# Altium project TweakWave - Main.PrjPcb
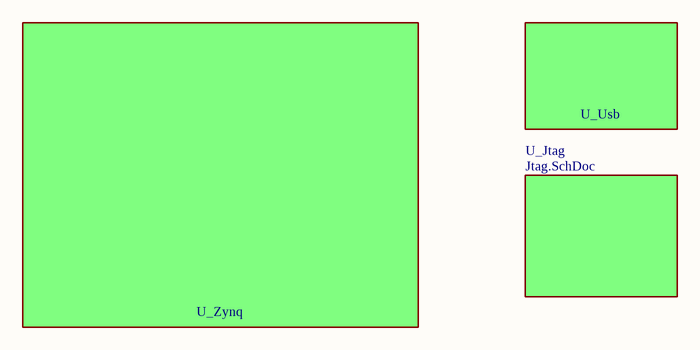
[diagram p0: TweakWave-Mainboard.SchDoc]
4 sheets, 20 parts. Net scope: flat (ports and power ports of the same name join across sheets).
Sheets:
  TweakWave-Mainboard.SchDoc
    U_Zynq = Zynq.SchDoc
    U_Usb = Usb.SchDoc
    U_Jtag = Jtag.SchDoc

## Sheet TweakWave-Mainboard.SchDoc
size A; SheetNumber: 1; SheetTotal: 4

### Sub-sheets
U_Jtag = Jtag.SchDoc: no entries
U_Usb = Usb.SchDoc: no entries
U_Zynq = Zynq.SchDoc: no entries

## Sheet Zynq.SchDoc
size A3; SheetNumber: 2; SheetTotal: 3
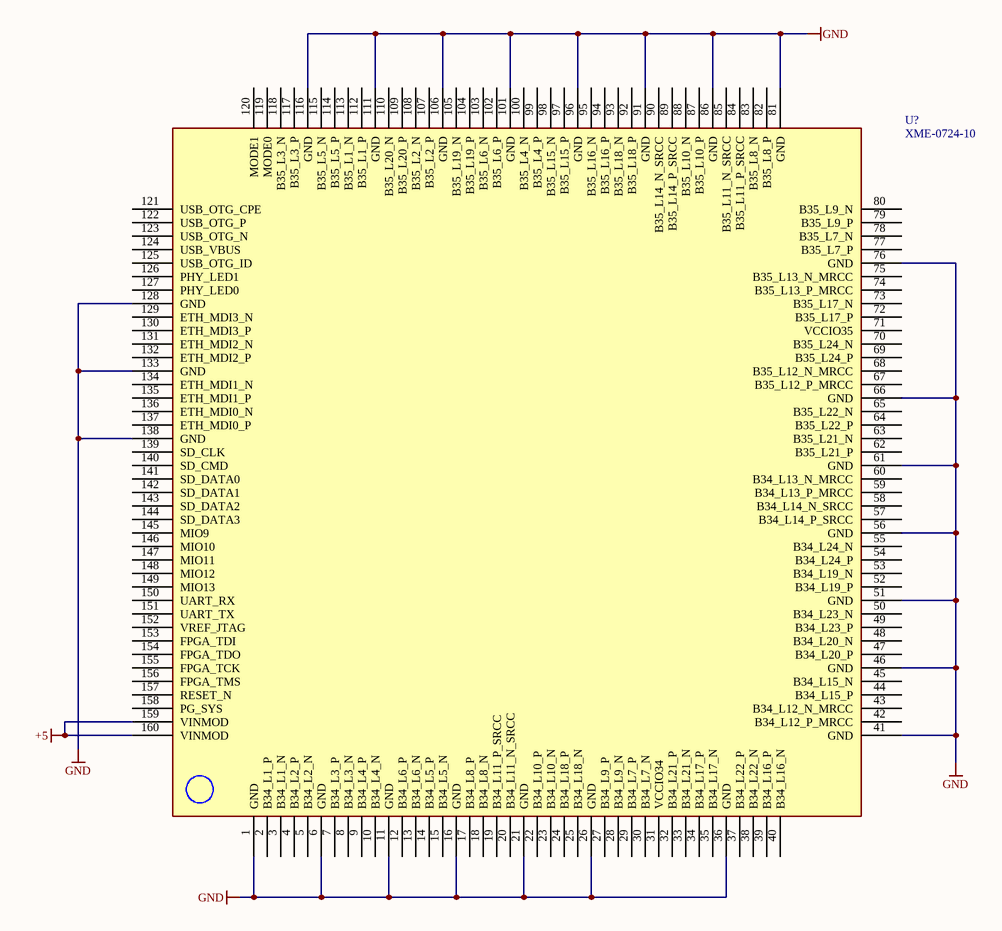
[diagram p1: Zynq.SchDoc]

### Parts
(Parts that share a designator on the sheet are numbered #1, #2 ... from top to bottom, then left to right.)
U?#1  XME-0724-10  [XME-0724-10-Footprint-1]

### Nets
+5: U?#1.159(VINMOD) U?#1.160(VINMOD)
GND: U?#1.1(GND) U?#1.6(GND) U?#1.11(GND) U?#1.16(GND) U?#1.21(GND) U?#1.26(GND) U?#1.36(GND) U?#1.41(GND) U?#1.46(GND) U?#1.51(GND) U?#1.56(GND) U?#1.61(GND) U?#1.66(GND) U?#1.76(GND) U?#1.81(GND) U?#1.86(GND) U?#1.91(GND) U?#1.96(GND) U?#1.101(GND) U?#1.106(GND) U?#1.111(GND) U?#1.116(GND) U?#1.128(GND) U?#1.133(GND) U?#1.138(GND)

Not connected (* = marked no-connect by the designer): U?#1 2(B34_L1_P) 3(B34_L1_N) 4(B34_L2_P) 5(B34_L2_N) 7(B34_L3_P) 8(B34_L3_N) 9(B34_L4_P) 10(B34_L4_N) 12(B34_L6_P) 13(B34_L6_N) 14(B34_L5_P) 15(B34_L5_N) 17(B34_L8_P) 18(B34_L8_N) 19(B34_L11_P_SRCC) 20(B34_L11_N_SRCC) 22(B34_L10_P) 23(B34_L10_N) 24(B34_L18_P) 25(B34_L18_N) 27(B34_L9_P) 28(B34_L9_N) 29(B34_L7_P) 30(B34_L7_N) 31(VCCIO34) 32(B34_L21_P) 33(B34_L21_N) 34(B34_L17_P) 35(B34_L17_N) 37(B34_L22_P) 38(B34_L22_N) 39(B34_L16_P) 40(B34_L16_N) 42(B34_L12_P_MRCC) 43(B34_L12_N_MRCC) 44(B34_L15_P) 45(B34_L15_N) 47(B34_L20_P) 48(B34_L20_N) 49(B34_L23_P) 50(B34_L23_N) 52(B34_L19_P) 53(B34_L19_N) 54(B34_L24_P) 55(B34_L24_N) 57(B34_L14_P_SRCC) 58(B34_L14_N_SRCC) 59(B34_L13_P_MRCC) 60(B34_L13_N_MRCC) 62(B35_L21_P) 63(B35_L21_N) 64(B35_L22_P) 65(B35_L22_N) 67(B35_L12_P_MRCC) 68(B35_L12_N_MRCC) 69(B35_L24_P) 70(B35_L24_N) 71(VCCIO35) 72(B35_L17_P) 73(B35_L17_N) 74(B35_L13_P_MRCC) 75(B35_L13_N_MRCC) 77(B35_L7_P) 78(B35_L7_N) 79(B35_L9_P) 80(B35_L9_N) 82(B35_L8_P) 83(B35_L8_N) 84(B35_L11_P_SRCC) 85(B35_L11_N_SRCC) 87(B35_L10_P) 88(B35_L10_N) 89(B35_L14_P_SRCC) 90(B35_L14_N_SRCC) 92(B35_L18_P) 93(B35_L18_N) 94(B35_L16_P) 95(B35_L16_N) 97(B35_L15_P) 98(B35_L15_N) 99(B35_L4_P) 100(B35_L4_N) 102(B35_L6_P) 103(B35_L6_N) 104(B35_L19_P) 105(B35_L19_N) 107(B35_L2_P) 108(B35_L2_N) 109(B35_L20_P) 110(B35_L20_N) 112(B35_L1_P) 113(B35_L1_N) 114(B35_L5_P) 115(B35_L5_N) 117(B35_L3_P) 118(B35_L3_N) 119(MODE0) 120(MODE1) 121(USB_OTG_CPE) 122(USB_OTG_P) 123(USB_OTG_N) 124(USB_VBUS) 125(USB_OTG_ID) 126(PHY_LED1) 127(PHY_LED0) 129(ETH_MDI3_N) 130(ETH_MDI3_P) 131(ETH_MDI2_N) 132(ETH_MDI2_P) 134(ETH_MDI1_N) 135(ETH_MDI1_P) 136(ETH_MDI0_N) 137(ETH_MDI0_P) 139(SD_CLK) 140(SD_CMD) 141(SD_DATA0) 142(SD_DATA1) 143(SD_DATA2) 144(SD_DATA3) 145(MIO9) 146(MIO10) 147(MIO11) 148(MIO12) 149(MIO13) 150(UART_RX) 151(UART_TX) 152(VREF_JTAG) 153(FPGA_TDI) 154(FPGA_TDO) 155(FPGA_TCK) 156(FPGA_TMS) 157(RESET_N) 158(PG_SYS)

### Library data of the parts
U?#1 = CMP-EMPU-00001-2: MicroPhase Zynq 7010 Module; pin to pad: 1>1+1A 2>2+2A 3>3+3A 4>4+4A 5>5+5A 6>6+6A 7>7+7A 8>8+8A 9>9+9A 10>10+10A 11>11+11A 12>12+12A 13>13+13A 14>14+14A 15>15+15A 16>16+16A 17>17+17A 18>18+18A 19>19+19A 20>20+20A 21>21+21A 22>22+22A 23>23+23A 24>24+24A 25>25+25A 26>26+26A 27>27+27A 28>28+28A 29>29+29A 30>30+30A 31>31+31A 32>32+32A 33>33+33A 34>34+34A 35>35+35A 36>36+36A 37>37+37A 38>38+38A 39>39+39A 40>40+40A 41>41+41A 42>42+42A 43>43+43A 44>44+44A 45>45+45A 46>46+46A 47>47+47A 48>48+48A 49>49+49A 50>50+50A 51>51+51A 52>52+52A 53>53+53A 54>54+54A 55>55+55A 56>56+56A 57>57+57A 58>58+58A 59>59+59A 60>60+60A 61>61+61A 62>62+62A 63>63+63A 64>64+64A 65>65+65A 66>66+66A 67>67+67A 68>68+68A 69>69+69A 70>70+70A 71>71+71A 72>72+72A 73>73+73A 74>74+74A 75>75+75A 76>76+76A 77>77+77A 78>78+78A 79>79+79A 80>80+80A 81>81+81A 82>82+82A 83>83+83A 84>84+84A 85>85+85A 86>86+86A 87>87+87A 88>88+88A 89>89+89A 90>90+90A 91>91+91A 92>92+92A 93>93+93A 94>94+94A 95>95+95A 96>96+96A 97>97+97A 98>98+98A 99>99+99A 100>100+100A 101>101+101A 102>102+102A 103>103+103A 104>104+104A 105>105+105A 106>106+106A 107>107+107A 108>108+108A 109>109+109A 110>110+110A 111>111+111A 112>112+112A 113>113+113A 114>114+114A 115>115+115A 116>116+116A 117>117+117A 118>118+118A 119>119+119A 120>120+120A 121>121+121A 122>122+122A 123>123+123A 124>124+124A 125>125+125A 126>126+126A 127>127+127A 128>128+128A 129>129+129A 130>130+130A 131>131+131A 132>132+132A 133>133+133A 134>134+134A 135>135+135A 136>136+136A 137>137+137A 138>138+138A 139>139+139A 140>140+140A 141>141+141A 142>142+142A 143>143+143A 144>144+144A 145>145+145A 146>146+146A 147>147+147A 148>148+148A 149>149+149A 150>150+150A 151>151+151A 152>152+152A 153>153+153A 154>154+154A 155>155+155A 156>156+156A 157>157+157A 158>158+158A 159>159+159A 160>160+160A

## Sheet Usb.SchDoc
size A3; SheetNumber: 3; SheetTotal: 4
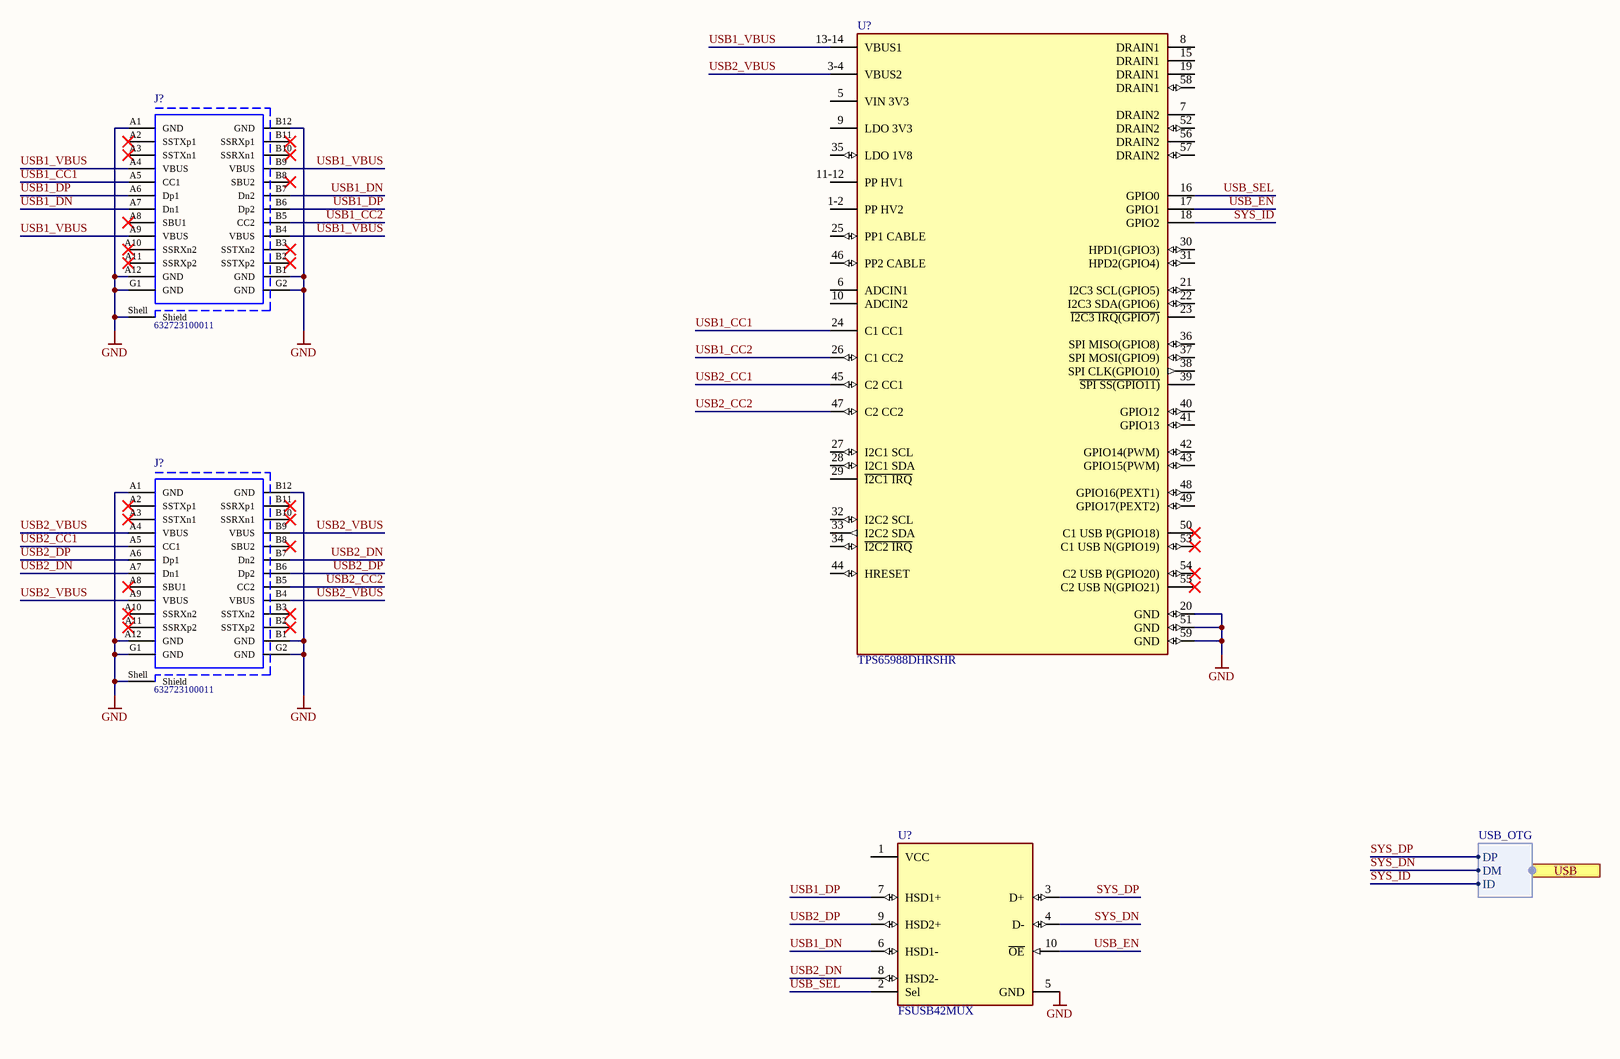
[diagram p2: Usb.SchDoc]

### Parts
(Parts that share a designator on the sheet are numbered #1, #2 ... from top to bottom, then left to right.)
J?#1  632723100011  [632723100011]
J?#2  632723100011  [632723100011]
U?#2  TPS65988DHRSHR  [FP-RSH0056E-MFG]
U?#3  FSUSB42MUX  [FP-846AP-MFG]

### Ports
USB (harness USB_OTG)

### Harnesses
USB_OTG: DP, DM, ID

### Nets
GND: J?#1.A1(GND) J?#1.A12(GND) J?#1.B1(GND) J?#1.B12(GND) J?#1.G1(GND) J?#1.G2(GND) J?#1.Shell(Shield) J?#2.A1(GND) J?#2.A12(GND) J?#2.B1(GND) J?#2.B12(GND) J?#2.G1(GND) J?#2.G2(GND) J?#2.Shell(Shield) U?#2.20(GND) U?#2.51(GND) U?#2.59(GND) U?#3.5(GND)
SYS_DN: U?#3.4(D-) ; port USB.DM
SYS_DP: U?#3.3(D+) ; port USB.DP
SYS_ID: U?#2.18(GPIO2) ; port USB.ID
USB1_CC1: J?#1.A5(CC1) U?#2.24(C1_CC1)
USB1_CC2: J?#1.B5(CC2) U?#2.26(C1_CC2)
USB1_DN: J?#1.A7(Dn1) J?#1.B7(Dn2) U?#3.6(HSD1-)
USB1_DP: J?#1.A6(Dp1) J?#1.B6(Dp2) U?#3.7(HSD1+)
USB1_VBUS: J?#1.A4(VBUS) J?#1.A9(VBUS) J?#1.B4(VBUS) J?#1.B9(VBUS) U?#2.13-14(VBUS1)
USB2_CC1: J?#2.A5(CC1) U?#2.45(C2_CC1)
USB2_CC2: J?#2.B5(CC2) U?#2.47(C2_CC2)
USB2_DN: J?#2.A7(Dn1) J?#2.B7(Dn2) U?#3.8(HSD2-)
USB2_DP: J?#2.A6(Dp1) J?#2.B6(Dp2) U?#3.9(HSD2+)
USB2_VBUS: J?#2.A4(VBUS) J?#2.A9(VBUS) J?#2.B4(VBUS) J?#2.B9(VBUS) U?#2.3-4(VBUS2)
USB_EN: U?#2.17(GPIO1) U?#3.10(~{OE})
USB_SEL: U?#2.16(GPIO0) U?#3.2(Sel)

Not connected (* = marked no-connect by the designer): J?#1 A2(SSTXp1)* A3(SSTXn1)* A8(SBU1)* A10(SSRXn2)* A11(SSRXp2)* B2(SSTXp2)* B3(SSTXn2)* B8(SBU2)* B10(SSRXn1)* B11(SSRXp1)*; J?#2 A2(SSTXp1)* A3(SSTXn1)* A8(SBU1)* A10(SSRXn2)* A11(SSRXp2)* B2(SSTXp2)* B3(SSTXn2)* B8(SBU2)* B10(SSRXn1)* B11(SSRXp1)*; U?#2 1-2(PP_HV2) 5(VIN_3V3) 6(ADCIN1) 7(DRAIN2) 8(DRAIN1) 9(LDO_3V3) 10(ADCIN2) 11-12(PP_HV1) 15(DRAIN1) 19(DRAIN1) 21(I2C3_SCL(GPIO5)) 22(I2C3_SDA(GPIO6)) 23(~{I2C3_IRQ(GPIO7)}) 25(PP1_CABLE) 27(I2C1_SCL) 28(I2C1_SDA) 29(~{I2C1_IRQ}) 30(HPD1(GPIO3)) 31(HPD2(GPIO4)) 32(I2C2_SCL) 33(I2C2_SDA) 34(~{I2C2_IRQ}) 35(LDO_1V8) 36(SPI_MISO(GPIO8)) 37(SPI_MOSI(GPIO9)) 38(SPI_CLK(GPIO10)) 39(~{SPI_SS(GPIO11)}) 40(GPIO12) 41(GPIO13) 42(GPIO14(PWM)) 43(GPIO15(PWM)) 44(HRESET) 46(PP2_CABLE) 48(GPIO16(PEXT1)) 49(GPIO17(PEXT2)) 50(C1_USB_P(GPIO18))* 52(DRAIN2) 53(C1_USB_N(GPIO19))* 54(C2_USB_P(GPIO20))* 55(C2_USB_N(GPIO21))* 56(DRAIN2) 57(DRAIN2) 58(DRAIN1); U?#3 1(VCC)

### Library data of the parts
J?#1 J?#2 = CMP-1502-03213-1: USB 3.1 Type C Receptacle WR-COM, Horizontal, SMT / THT; Manufacturer: Wurth Elektronik; Working Voltage: 20VDC; Rated Current: 5A; Contact Resistance: 30mOhm; Operating Temperature: -40to105degC; Publisher: WurthElektronik; Gender: Receptacle; Part Number: 632723100011; Mounting Technology: SMT/THT; Datasheet URL: https://katalog.we-online.de/em/datasheet/632723x00011%282%29.pdf; Connector Type: USB3.1TypeC; Manufacturer URL: http://www.we-online.de; Orientation: Horizontal; Package Reference: 632723100011; Packaging: TapeandReel
U?#2 = CMP-04877-000032-1: ACELITE 88 ROM 1.6 PROTO 7X7; Operating Supply Current: 45uA; RoHS Compliant: Yes; Packaging: Cut Tape; Max Operating Temperature: 85°C; Case/Package: VQFN; Min Operating Temperature: -40°C; Mount: Surface Mount
U?#3 = CMP-07103-000004-1: IC USB SWITCH DPDT 10MSOP; Voltage: 4.3V; Current: 100mA; Number of Inputs: 2; Supply Type: Single; Number of Outputs: 4; Data Rate: 480Mbps; On-State Resistance: 6.5R; Min Supply Voltage: 3V; Package Quantity: 1; Length: 3mm; Radiation Hardening: No; Number of Pins: 10; Width: 3mm; Number of Channels: 2; REACH SVHC: No SVHC; Lead Free: Lead Free; Max Operating Temperature: 85°C; Min Operating Temperature: -40°C; Packaging: Tape and Reel; Throw Configuration: DPDT; Operating Supply Voltage: 4.3V; Max Supply Voltage: 4.3V; Mount: Surface Mount; Case/Package: MSOP; Weight: 0.1125g; Height: 0.85mm

## Sheet Jtag.SchDoc
size A; SheetNumber: 4; SheetTotal: 4
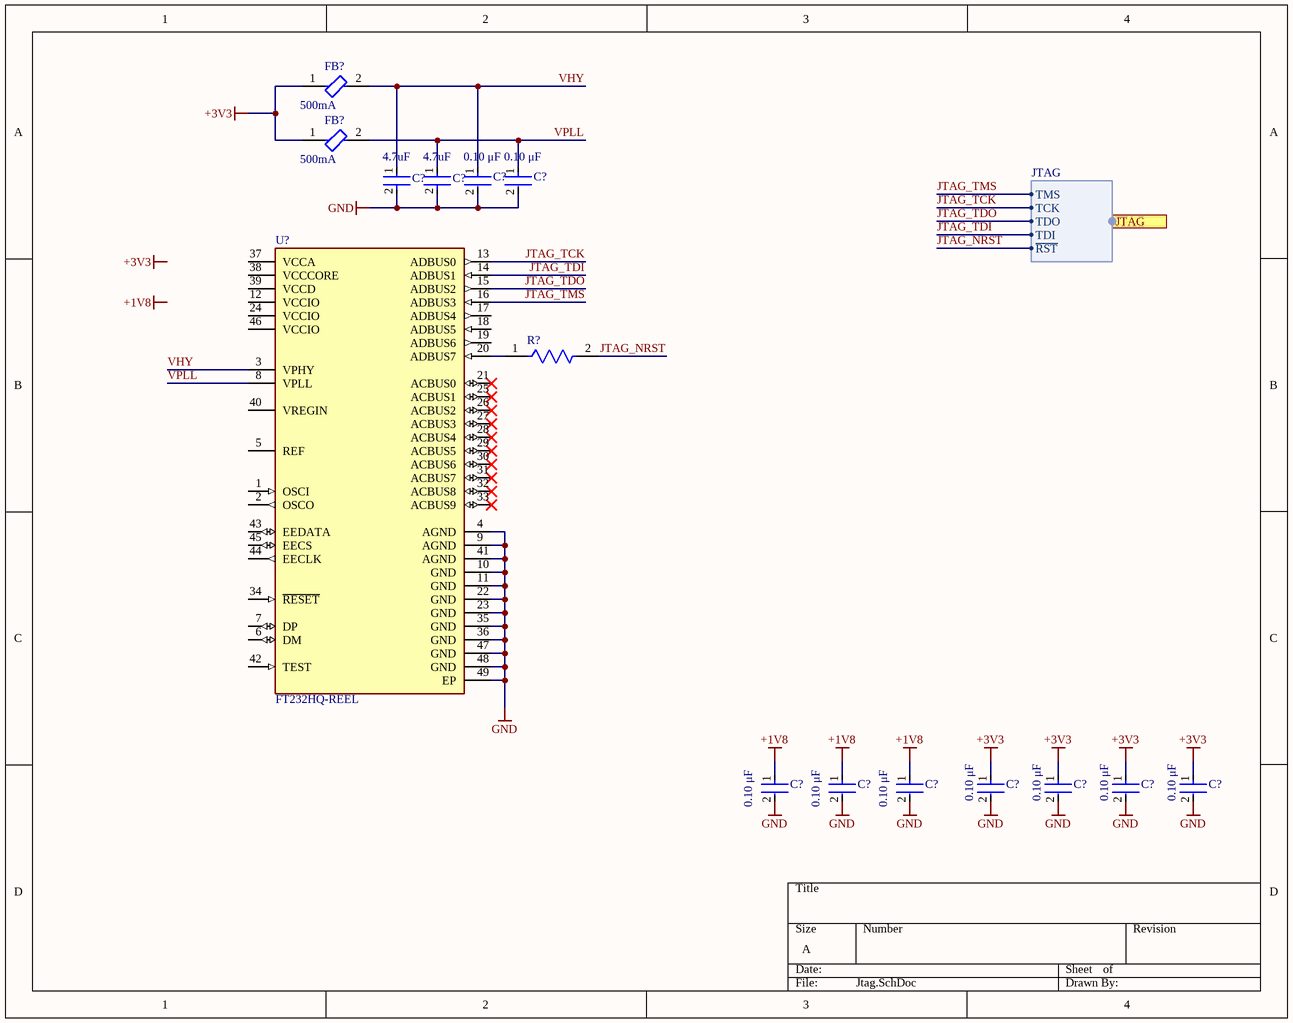
[diagram p3: Jtag.SchDoc]

### Parts
(Parts that share a designator on the sheet are numbered #1, #2 ... from top to bottom, then left to right.)
C?#1  Capacitance: 0.10 μF  [FP-C0402-BB-MFG]  (hidden comment: C0402C104K8PACTU)
C?#2  Capacitance: 0.10 μF  [FP-C0402-BB-MFG]  (hidden comment: C0402C104K8PACTU)
C?#3  Capacitance: 4.7uF  [FP-GRM188-0_1-MFG]  (hidden comment: GRM188R60J475KE19D)
C?#4  Capacitance: 4.7uF  [FP-GRM188-0_1-MFG]  (hidden comment: GRM188R60J475KE19D)
C?#5  Capacitance: 0.10 μF  [FP-C0402-BB-MFG]  (hidden comment: C0402C104K8PACTU)
C?#6  Capacitance: 0.10 μF  [FP-C0402-BB-MFG]  (hidden comment: C0402C104K8PACTU)
C?#7  Capacitance: 0.10 μF  [FP-C0402-BB-MFG]  (hidden comment: C0402C104K8PACTU)
C?#8  Capacitance: 0.10 μF  [FP-C0402-BB-MFG]  (hidden comment: C0402C104K8PACTU)
C?#9  Capacitance: 0.10 μF  [FP-C0402-BB-MFG]  (hidden comment: C0402C104K8PACTU)
C?#10  Capacitance: 0.10 μF  [FP-C0402-BB-MFG]  (hidden comment: C0402C104K8PACTU)
C?#11  Capacitance: 0.10 μF  [FP-C0402-BB-MFG]  (hidden comment: C0402C104K8PACTU)
FB?#1  Max DC Current: 500mA  [FP-BLM18-0_15-t0_8-MFG]  (hidden comment: BLM18AG601SN1D)
FB?#2  Max DC Current: 500mA  [FP-BLM18-0_15-t0_8-MFG]  (hidden comment: BLM18AG601SN1D)
R?  CRCW04020000Z0ED  [FP-CRCW0402-e3-IPC_C]  (value not drawn)
U?#4  FT232HQ-REEL  [FP-QFN-48-MFG]

### Ports
JTAG (harness JTAG)

### Harnesses
JTAG: TMS, TCK, TDO, TDI, ~{RST}

### Nets
+1V8: C?#5.1 C?#6.1 C?#7.1
+3V3: C?#8.1 C?#9.1 C?#10.1 C?#11.1 FB?#1.1 FB?#2.1
GND: C?#1.2 C?#2.2 C?#3.2 C?#4.2 C?#5.2 C?#6.2 C?#7.2 C?#8.2 C?#9.2 C?#10.2 C?#11.2 U?#4.4(AGND) U?#4.9(AGND) U?#4.10(GND) U?#4.11(GND) U?#4.22(GND) U?#4.23(GND) U?#4.35(GND) U?#4.36(GND) U?#4.41(AGND) U?#4.47(GND) U?#4.48(GND) U?#4.49(EP)
JTAG_NRST: R?.2 ; port JTAG.~{RST}
JTAG_TCK: U?#4.13(ADBUS0) ; port JTAG.TCK
JTAG_TDI: U?#4.14(ADBUS1) ; port JTAG.TDI
JTAG_TDO: U?#4.15(ADBUS2) ; port JTAG.TDO
JTAG_TMS: U?#4.16(ADBUS3) ; port JTAG.TMS
VHY: C?#1.1 C?#3.1 FB?#1.2 U?#4.3(VPHY)
VPLL: C?#2.1 C?#4.1 FB?#2.2 U?#4.8(VPLL)
NetR?_1: R?.1 U?#4.20(ADBUS7)

Not connected (* = marked no-connect by the designer): U?#4 1(OSCI) 2(OSCO) 5(REF) 6(DM) 7(DP) 12(VCCIO) 17(ADBUS4) 18(ADBUS5) 19(ADBUS6) 21(ACBUS0)* 24(VCCIO) 25(ACBUS1)* 26(ACBUS2)* 27(ACBUS3)* 28(ACBUS4)* 29(ACBUS5)* 30(ACBUS6)* 31(ACBUS7)* 32(ACBUS8)* 33(ACBUS9)* 34(~{RESET}) 37(VCCA) 38(VCCCORE) 39(VCCD) 40(VREGIN) 42(TEST) 43(EEDATA) 44(EECLK) 45(EECS) 46(VCCIO)

### Notes on the sheet
- Labels drawn without touching a wire or pin: +1V8, +3V3

### Library data of the parts
C?#1 C?#2 C?#5-C?#11 = CMP-2008-02046-2: CAP CER 0.1UF 10V X5R 0402; Manufacturer: Kemet; Material: Ceramic; Temperature Coefficient: 15%; Description: C0402 0.10 μF X5R 10.00% 10 V; Tolerance: 0.1; Value: 0.10 μF; Package: C0402-BB; Temperature: -55°C to +125°C; ComponentLink2Description: Datasheet; Temperature Characteristic: X5R; Device Class L1: Passive Components; Height: 0.55mm; Lead Free: Yes; ComponentLink2URL: https://content.kemet.com/datasheets/KEM_C1002_X7R_SMD.pdf; Device Class L2: Capacitors; Temperature Range Low: -55°C; Temperature Range High: +125°C; RoHS: TRUE; Octopart: https://octopart.com/c0402c104k8pactu-kemet-140039; Automotive: No; Mouser Description: Capacitor 100 nF 10 VDC 0402; Category: Cap; Voltage Rating: 10 V; Digikey Description: CAP CER 0.1UF 10V X5R 0402; Ipc Land Pattern Name: CAPC10050X50; Device Class L3: Ceramic Capacitors; Manufacturer Part Number: C0402C104K8PACTU
C?#3 C?#4 = CMP-2006-02799-3: CAP CER 4.7UF 6.3V X5R 0603; Material: Ceramic; Tolerance: 10%; Max Operating Temperature: 85°C; REACH SVHC: No SVHC; Thickness: 0.035inch; Voltage Rating: 6.3V; Package Quantity: 1; Radiation Hardening: No; Voltage: 6.3V; Case Code (Metric): 1608; Dielectric: X5R; Mount: Surface Mount; RoHS Compliant: Yes; Height: 0.8mm; Voltage Rating (DC): 6.3V; Width: 0.8mm; Lead Free: Lead Free; Case Code (Imperial): 0603; Packaging: Tape and Reel; Length: 1.6mm; Case/Package: 0603; Termination: SMD/SMT; Min Operating Temperature: -55°C; Depth: 0.8mm
FB?#1 FB?#2 = CMP-0686-00436-3: Chip Ferrite Bead, 0603, 600Ω @ 100MHz, 0.38Ω, 25%, 500mA; Number of Lines: 1; Impedance: 600R; DC Resistance (DCR): 380mR; Material: Steel; Shielding: Unshielded; Termination: SMD/SMT; Military Standard: Not; Number of Circuits: 1; Min Operating Temperature: -55°C; Case Code (Imperial): 0603; Width: 0.8mm; Current Rating: 500mA; Lead Free: Lead Free; Packaging: Tape and Reel; Frequency: 100MHz; Max Operating Temperature: 125°C; DC Current: 500mA; REACH SVHC: No SVHC; Case/Package: 0603; Package Quantity: 1; Height: 0.8mm; Number of Pins: 2; Depth: 0.8mm; Test Frequency: 100MHz; Case Code (Metric): 1608; Tolerance: 25%; Core Material: Ferrite; Weight: 7.1E-05oz; Max Current Rating: 500mA; Radiation Hardening: No; Length: 1.6mm; RoHS Compliant: Yes
R? = CMP-2002-08122-2: RES Thick Film, 0Ω, 0.063W, 0402; Tolerance: 5%; Max Power Dissipation: 63mW; Voltage Rating: 50V; Temperature Coefficient: 100ppm/°C; Resistance: 0mR; Contact Plating: Tin; Height: 0.35mm; Radiation Hardening: No; Features: Automotive AEC-Q200; Composition: Thick Film; Width: 0.5mm; Weight: 2.3E-05oz; Termination: SMD/SMT; Packaging: Tape and Reel; Mount: Surface Mount; Case Code (Metric): 1005; Military Standard: Not; Min Operating Temperature: -55°C; Number of Terminations: 2; Package Quantity: 1; Case Code (Imperial): 0402; Depth: 0.5mm; Max Operating Temperature: 155°C; Case/Package: 0402; Power Rating: 63mW; Lead Free: Lead Free; Voltage Rating (DC): 50V; Length: 1mm
U?#4 = CMP-0078-00034-4: IC HS USB TO UART/FIFO 48QFN; Number of Channels: 1; Max Supply Voltage: 3.63V; Min Supply Voltage: 2.97V; Operating Supply Current: 24mA; Data Rate: 12Mbps; Interface: UART; Nominal Supply Current: 60mA; Operating Supply Voltage: 3.3V; Case/Package: QFN; Packaging: Tape and Reel; Weight: 0.005309oz; Number of Pins: 48; REACH SVHC: No SVHC; Length: 7mm; Mount: Surface Mount; Package Quantity: 1; Lead Free: Lead Free; Radiation Hardening: No; Max Operating Temperature: 85°C; Min Operating Temperature: -40°C; Height: 1.4mm; Width: 7mm

## Nets that join several sheets
GND: Zynq (25 pins), Usb (18 pins), Jtag (23 pins)